# Altium schematic sheet [1]- Schematic Blocks.SchDoc: Sitara AM3358 Processor Board
size A4; Author: AVIRAL MISHRA; SheetNumber: 1; SheetTotal: 1; PROJECT CODE: A_V1.3
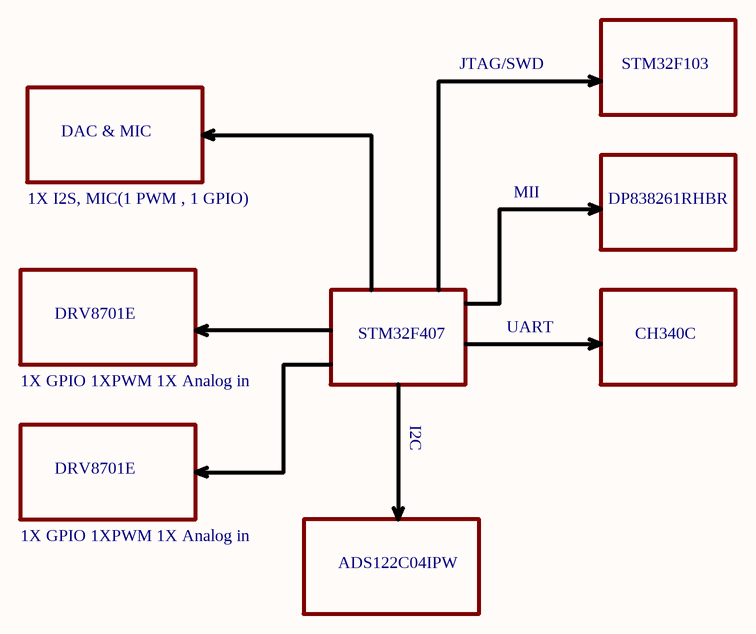
[diagram p0: [1]- Schematic Blocks.SchDoc]

## Notes on the sheet
- JTAG/SWD
- STM32F103
- DAC & MIC
- 1X I2S, MIC(1 PWM , 1 GPIO)
- MII
- DP838261RHBR
- DRV8701E
- STM32F407
- UART
- CH340C
- 1X GPIO 1XPWM 1X Analog in
- I2C
- ADS122C04IPW
- TITLE:
- DOCUMENT NAME:
- SCALE 1:1
- This document is copyright of EsteemPCB and shall not be revealed, produced, copied, in whole or in part, nor
- PROJECT CODE:
- TEMPLATE:
- A4
- AUTHOR:
- Sheet
- of
- used for any purpose other than submitted.